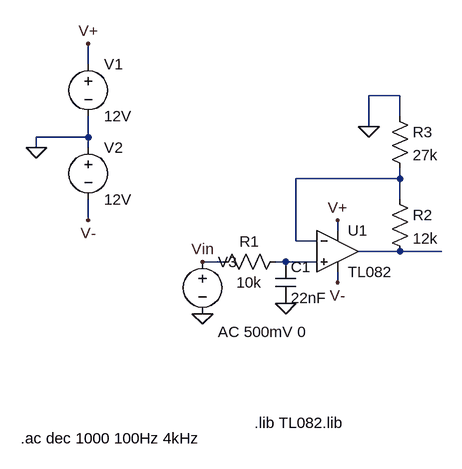
[diagram p0: schematic Stage1.asc]
Stage1.asc, the LTspice schematic file:
Version 4
SHEET 1 880 680
WIRE -240 -128 -240 -160
WIRE 240 -80 192 -80
WIRE 240 -48 240 -80
WIRE 192 -32 192 -80
WIRE -240 -16 -240 -48
WIRE -240 -16 -320 -16
WIRE -320 0 -320 -16
WIRE -240 0 -240 -16
WIRE 240 48 240 32
WIRE 240 48 80 48
WIRE 240 80 240 48
WIRE -240 112 -240 80
WIRE 144 128 144 112
WIRE 80 144 80 48
WIRE 112 144 80 144
WIRE 240 160 176 160
WIRE 304 160 240 160
WIRE -32 176 -64 176
WIRE 64 176 48 176
WIRE 112 176 64 176
WIRE 144 208 144 192
FLAG 192 -32 0
FLAG 64 240 0
FLAG -320 0 0
FLAG -240 -160 V+
FLAG 144 112 V+
FLAG -240 112 V-
FLAG -64 256 0
FLAG 144 208 V-
FLAG -64 176 Vin
SYMBOL Opamps\\opamp2 144 96 R0
SYMATTR InstName U1
SYMATTR Value TL082
SYMBOL res 64 160 R90
WINDOW 0 0 56 VBottom 2
WINDOW 3 32 56 VTop 2
SYMATTR InstName R1
SYMATTR Value 10k
SYMBOL res 224 64 R0
SYMATTR InstName R2
SYMATTR Value 12k
SYMBOL res 224 -64 R0
SYMATTR InstName R3
SYMATTR Value 27k
SYMBOL cap 48 176 R0
SYMATTR InstName C1
SYMATTR Value 22nF
SYMBOL voltage -240 -144 R0
WINDOW 123 0 0 Left 0
WINDOW 39 0 0 Left 0
SYMATTR InstName V1
SYMATTR Value 12V
SYMBOL voltage -240 -16 R0
WINDOW 123 0 0 Left 0
WINDOW 39 0 0 Left 0
SYMATTR InstName V2
SYMATTR Value 12V
SYMBOL voltage -64 160 R0
WINDOW 123 24 124 Left 2
WINDOW 39 0 0 Left 0
SYMATTR Value2 AC 500mV 0
SYMATTR InstName V3
SYMATTR Value ""
TEXT 16 424 Left 2 !.lib TL082.lib
TEXT -344 448 Left 2 !.ac dec 1000 100Hz 4kHz

The netlist it stands for:
* Stage1.asc
XU1 N003 N001 V+ V- N002 TL082  ; pins In+ In- V+ V- OUT
R1 N003 Vin 10k
R2 N001 N002 12k
R3 0 N001 27k
C1 N003 0 22nF
V1 V+ 0 12V
V2 0 V- 12V
V3 Vin 0 AC 500mV 0
.lib TL082.lib
.ac dec 1000 100Hz 4kHz
.backanno
.end